# Altium schematic sheet top-level.SchDoc
size A4; SheetNumber: 1; SheetTotal: 3
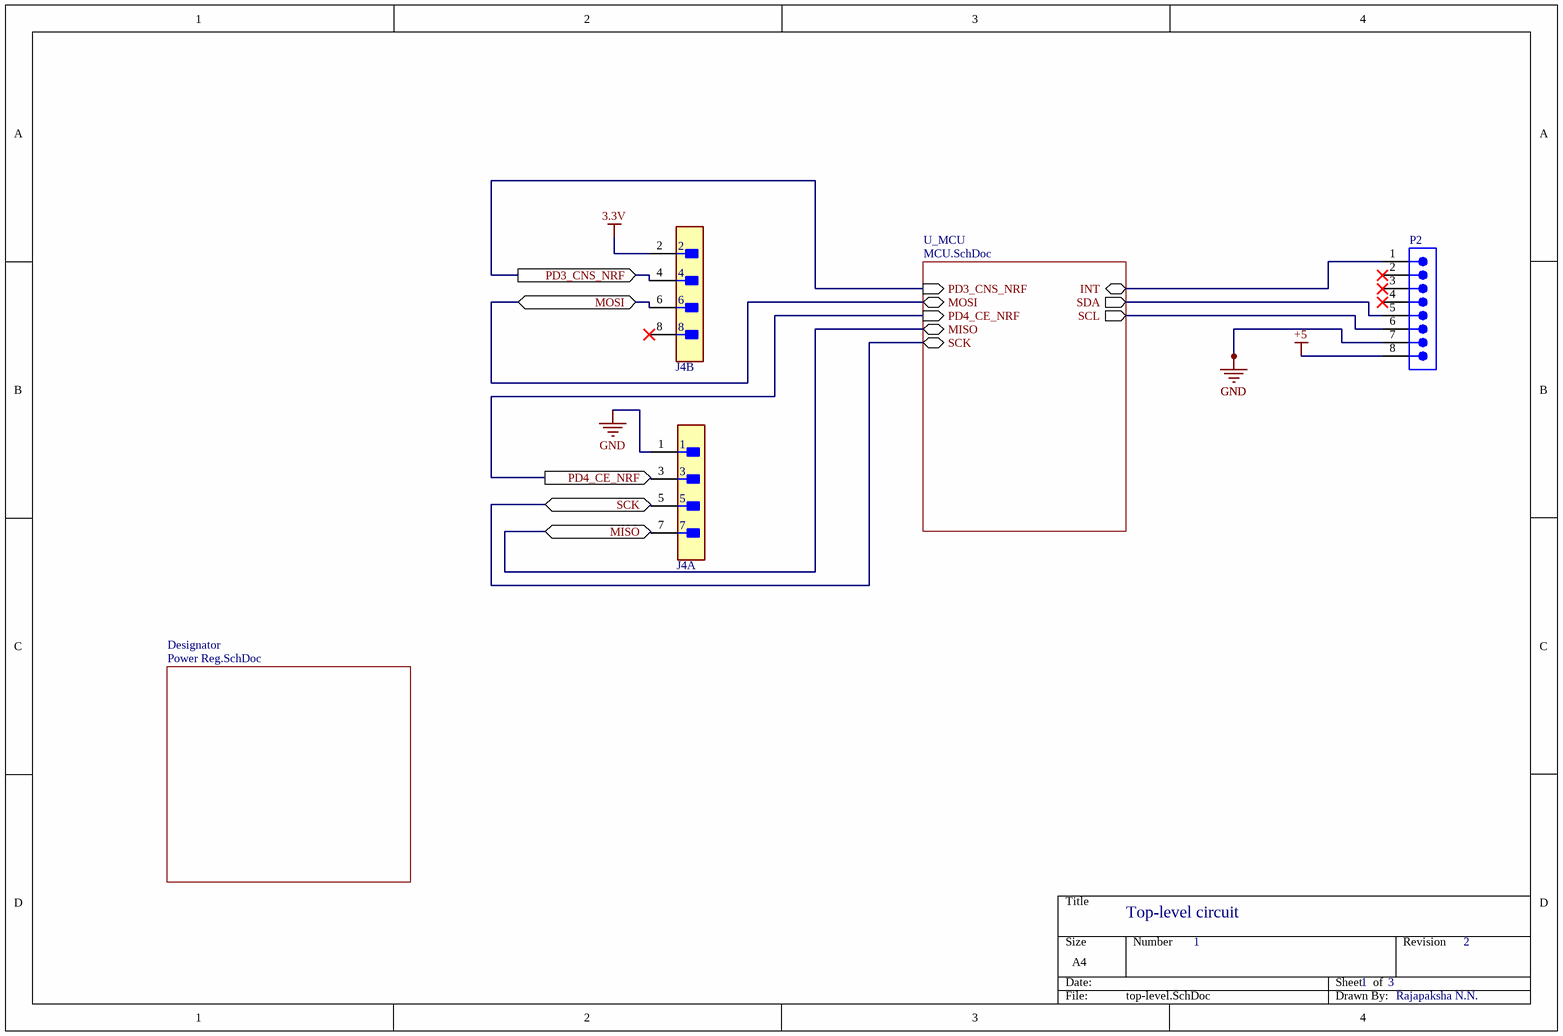
[diagram p0: top-level.SchDoc]

## Parts
J4  PBC04DAAN  [FP-PBC04DAAN-MFG]  (value not drawn)  (parts A,B of 2)
P2  61300811121  [61300811121]  (value not drawn)

## Sub-sheets
Designator = Power Reg.SchDoc: no entries
U_MCU = MCU.SchDoc: SDA (out), SCL (out), MOSI (bidir), MISO (bidir), SCK (bidir), PD3_CNS_NRF (in), PD4_CE_NRF (in), INT (bidir)

## Ports
MISO (bidir), MOSI (bidir), PD3_CNS_NRF (out), PD4_CE_NRF (out), SCK (bidir)

## Nets
3.3V: J4.2
+5: P2.8
GND: J4.1 P2.7
MISO: J4.7 ; port MISO, sheet U_MCU/MISO
MOSI: J4.6 ; port MOSI, sheet U_MCU/MOSI
PD3_CNS_NRF: J4.4 ; port PD3_CNS_NRF, sheet U_MCU/PD3_CNS_NRF
PD4_CE_NRF: J4.3 ; port PD4_CE_NRF, sheet U_MCU/PD4_CE_NRF
SCK: J4.5 ; port SCK, sheet U_MCU/SCK
NetP2_1: P2.1 ; sheet U_MCU/INT
NetP2_5: P2.5 ; sheet U_MCU/SDA
NetP2_6: P2.6 ; sheet U_MCU/SCL

Not connected (* = marked no-connect by the designer): J4 8*; P2 2* 3* 4*

## Notes on the sheet
- Top-level circuit
- 1
- 3
- 2
- Rajapaksha N.N.

## Library data of the parts
J4 = CMP-25680-000082-1: CONN HEADER VERT 8POS 2.54MM; Number of Positions: 8; Pitch: 0.1inch; Gender: Male; Connector Type: Male Pin; Length: 10.2mm; Contact Plating: Gold; Housing Color: Black; RoHS Compliant: Yes; Termination: Solder; Number of Contacts: 8; Mount: Through Hole; Color: Black; Housing Material: Plastic; Number of Rows: 2; Contact Material: Bronze; Lead Free: Lead Free; Contact Type: Male Pin; Height: 2.54mm; Packaging: Bulk; Width: 5.08mm; Package Quantity: 1; Contact Mating Length: 0.23inch; Row Spacing: 0.1inch
P2 = CMP-1502-01076-2: NexarPartId: 32855533; Current Rating: 3A; Connector Type: Male Pin; Voltage Rating: 250V; Number of Contacts: 8; Pitch: 2.54mm; Contact Resistance: 20mΩ; Gender: Male; REACH SVHC: Unknown; Number of Rows: 1; Mount: Through Hole; Termination: Solder; Number of Pins: 8; Number of Positions: 8; Height: 8.54mm; Contact Mating Length: 5.9944mm; Orientation: Vertical; Operating Supply Voltage: 250V; Min Operating Temperature: -40°C; Max Operating Temperature: 105°C; Packaging: Bulk; Color: Black; Lead Pitch: 2.54mm; RoHS: Compliant; Contact Material: Copper; Contact Plating: Gold